# EAGLE schematic 3ch mix 1.6 (EAGLE 6.5.0)
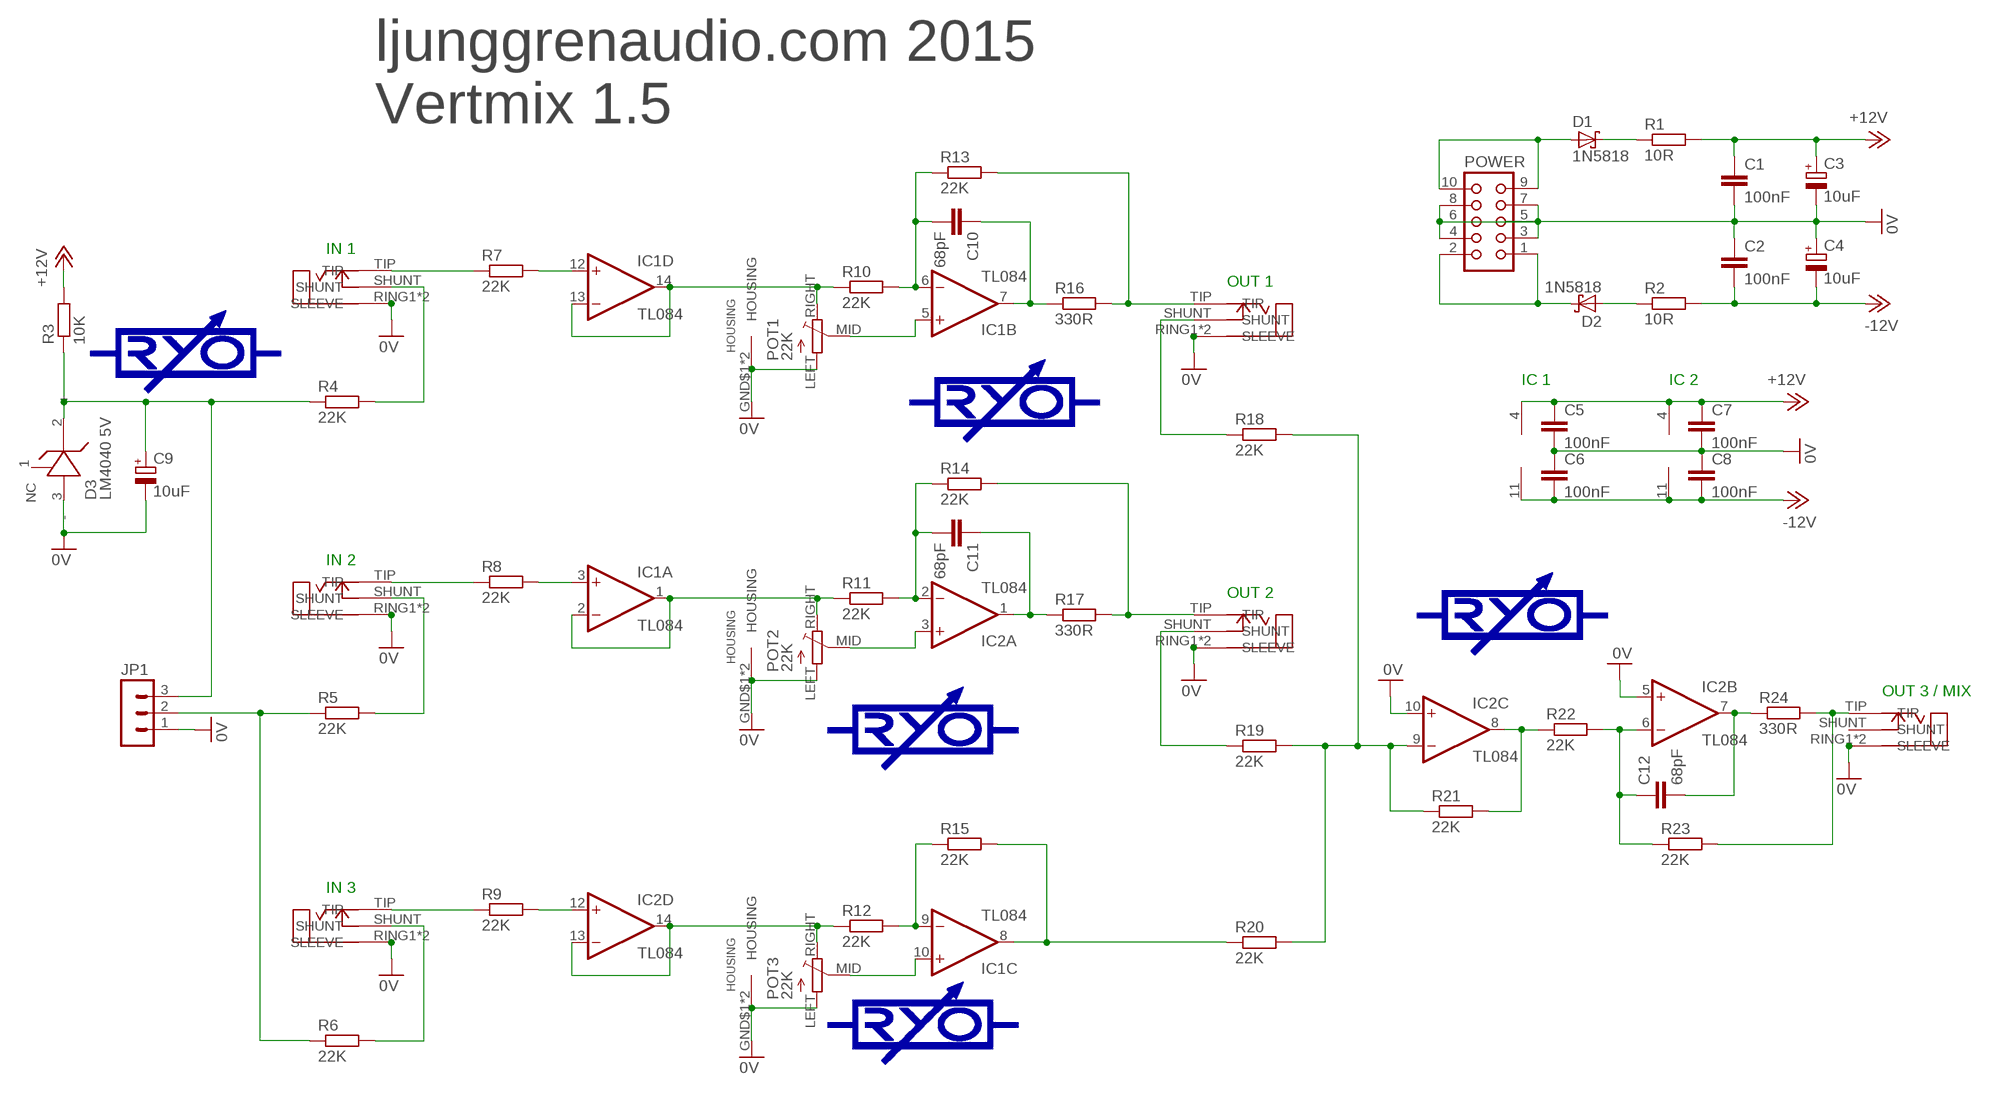
[diagram p0: schematic, sheet 1]

## Parts
C1  100nF  C-EUC0805K  [C0805K]
C2  100nF  C-EUC0805K  [C0805K]
C3  10uF  CPOL-EUE2-5  [E2-5]
C4  10uF  CPOL-EUE2-5  [E2-5]
C5  100nF  C-EUC0805K  [C0805K]
C6  100nF  C-EUC0805K  [C0805K]
C7  100nF  C-EUC0805K  [C0805K]
C8  100nF  C-EUC0805K  [C0805K]
C9  10uF  CPOL-EUE2-5  [E2-5]
C10  68pF  C-EUC0805K  [C0805K]
C11  68pF  C-EUC0805K  [C0805K]
C12  68pF  C-EUC0805K  [C0805K]
D1  1N5818  SB130DO-204AL  [DO41-7]
D2  1N5818  SB130DO-204AL  [DO41-7]
D3  LM4040 5V  LM4040  [TO92-LINE]
IC1  TL084  TL074P  [DIL14]
IC2  TL084  TL074P  [DIL14]
IN1  ERTHENVAR_3.5MM_JACKHOLES  [ERTHENVAR]
IN2  ERTHENVAR_3.5MM_JACKHOLES  [ERTHENVAR]
IN3  ERTHENVAR_3.5MM_JACKHOLES  [ERTHENVAR]
JP1  MA03-1  [MA03-1]
OUT1  ERTHENVAR_3.5MM_JACKHOLES  [ERTHENVAR]
OUT2  ERTHENVAR_3.5MM_JACKHOLES  [ERTHENVAR]
OUT3  ERTHENVAR_3.5MM_JACKHOLES  [ERTHENVAR]
POT1  22K  POT-ALPHA9  [POT-ALPHA9]
POT2  22K  POT-ALPHA9  [POT-ALPHA9]
POT3  22K  POT-ALPHA9  [POT-ALPHA9]
POWER  CON10L  [CON10L]
R1  10R  R-EU_R0805K  [C0805K]
R2  10R  R-EU_R0805K  [C0805K]
R3  10K  R-EU_R0805K  [C0805K]
R4  22K  R-EU_R0805K  [C0805K]
R5  22K  R-EU_R0805K  [C0805K]
R6  22K  R-EU_R0805K  [C0805K]
R7  22K  R-EU_R0805K  [C0805K]
R8  22K  R-EU_R0805K  [C0805K]
R9  22K  R-EU_R0805K  [C0805K]
R10  22K  R-EU_R0805K  [C0805K]
R11  22K  R-EU_R0805K  [C0805K]
R12  22K  R-EU_R0805K  [C0805K]
R13  22K  R-EU_R0805K  [C0805K]
R14  22K  R-EU_R0805K  [C0805K]
R15  22K  R-EU_R0805K  [C0805K]
R16  330R  R-EU_R0805K  [C0805K]
R17  330R  R-EU_R0805K  [C0805K]
R18  22K  R-EU_R0805K  [C0805K]
R19  22K  R-EU_R0805K  [C0805K]
R20  22K  R-EU_R0805K  [C0805K]
R21  22K  R-EU_R0805K  [C0805K]
R22  22K  R-EU_R0805K  [C0805K]
R23  22K  R-EU_R0805K  [C0805K]
R24  330R  R-EU_R0805K  [C0805K]

## Nets
0V: C1.2 C2.1 C3.- C4.+ C5.2 C6.1 C7.2 C8.1 C9.- D3.3(-) IC2.5(B:+IN) IC2.10(C:+IN) IN1.RING1(SLEEVE) IN1.RING2(SLEEVE) IN2.RING1(SLEEVE) IN2.RING2(SLEEVE) IN3.RING1(SLEEVE) IN3.RING2(SLEEVE) JP1.1 OUT1.RING1(SLEEVE) OUT1.RING2(SLEEVE) OUT2.RING1(SLEEVE) OUT2.RING2(SLEEVE) OUT3.RING1(SLEEVE) OUT3.RING2(SLEEVE) POT1.GND$1(HOUSING) POT1.GND$2(HOUSING) POT1.LEFT POT2.GND$1(HOUSING) POT2.GND$2(HOUSING) POT2.LEFT POT3.GND$1(HOUSING) POT3.GND$2(HOUSING) POT3.LEFT POWER.3 POWER.4 POWER.5 POWER.6 POWER.7 POWER.8
+12V: C1.1 C3.+ C5.1 C7.1 IC1.4(P:V+) IC2.4(P:V+) R1.2 R3.2
-12V: C2.2 C4.- C6.2 C8.2 IC1.11(P:V-) IC2.11(P:V-) R2.2
N$1: D1.A POWER.9 POWER.10
N$2: D2.C POWER.1 POWER.2
N$3: IC2.8(C:OUT) R21.2 R22.1
N$4: C12.1 IC2.6(B:-IN) R22.2 R23.1
N$5: D1.C R1.1
N$6: D2.A R2.1
N$7: C9.+ D3.2(+) JP1.3 R3.1 R4.1
N$8: OUT1.TIP R13.2 R16.2
N$9: IC1.12(D:+IN) R7.2
N$10: IC1.3(A:+IN) R8.2
N$11: IC2.12(D:+IN) R9.2
N$12: IC1.13(D:-IN) IC1.14(D:OUT) POT1.RIGHT R10.1
N$13: IC1.1(A:OUT) IC1.2(A:-IN) POT2.RIGHT R11.1
N$14: IC2.13(D:-IN) IC2.14(D:OUT) POT3.RIGHT R12.1
N$15: C10.2 IC1.6(B:-IN) R10.2 R13.1
N$16: IC1.5(B:+IN) POT1.MID
N$17: IC2.3(A:+IN) POT2.MID
N$18: IC1.10(C:+IN) POT3.MID
N$19: OUT2.TIP R14.2 R17.2
N$20: IN1.TIP R7.1
N$21: C11.2 IC2.2(A:-IN) R11.2 R14.1
N$22: IC1.9(C:-IN) R12.2 R15.1
N$23: OUT3.TIP R23.2 R24.2
N$24: IN2.TIP R8.1
N$25: IC1.8(C:OUT) R15.2 R20.1
N$26: OUT1.SHUNT R18.1
N$27: OUT2.SHUNT R19.1
N$28: IC2.9(C:-IN) R18.2 R19.2 R20.2 R21.1
N$29: C12.2 IC2.7(B:OUT) R24.1
N$30: IN1.SHUNT R4.2
N$31: IN2.SHUNT R5.2
N$32: IN3.SHUNT R6.2
N$33: JP1.2 R5.1 R6.1
N$34: IN3.TIP R9.1
N$35: C10.1 IC1.7(B:OUT) R16.1
N$36: C11.1 IC2.1(A:OUT) R17.1
Unconnected: D3.1(NC) OUT3.SHUNT

## Notes on the sheet
- ljunggrenaudio.com 2015
  Vertmix 1.5
- IN 1
- OUT 1
- HOUSING
- IC 1 | IC 2
- IN 2
- OUT 2
- HOUSING
- OUT 3 / MIX
- IN 3
- HOUSING

## Library data of the parts
C1 C2 C5-C8 C10-C12 = Roll Your Own:C-EU: CAPACITOR, European symbol
C3 C4 C9 = Roll Your Own:CPOL-EU: POLARIZED CAPACITOR, European symbol
D1 D2 = Roll Your Own:SB130
D3 = Roll Your Own:LM4040
IC1 IC2 = Roll Your Own:TL074: OP AMP
IN1-IN3 OUT1-OUT3 = Roll Your Own:ERTHENVAR_3.5MM_JACK
JP1 = Roll Your Own:MA03-1: PIN HEADER; OC_FARNELL: unknown; OC_NEWARK: unknown
POT1-POT3 = Roll Your Own:POT-ALPHA9
POWER = Roll Your Own:CON10L: CONNECTOR; OC_FARNELL: unknown; OC_NEWARK: unknown
R1-R24 = Roll Your Own:R-EU_: RESISTOR, European symbol